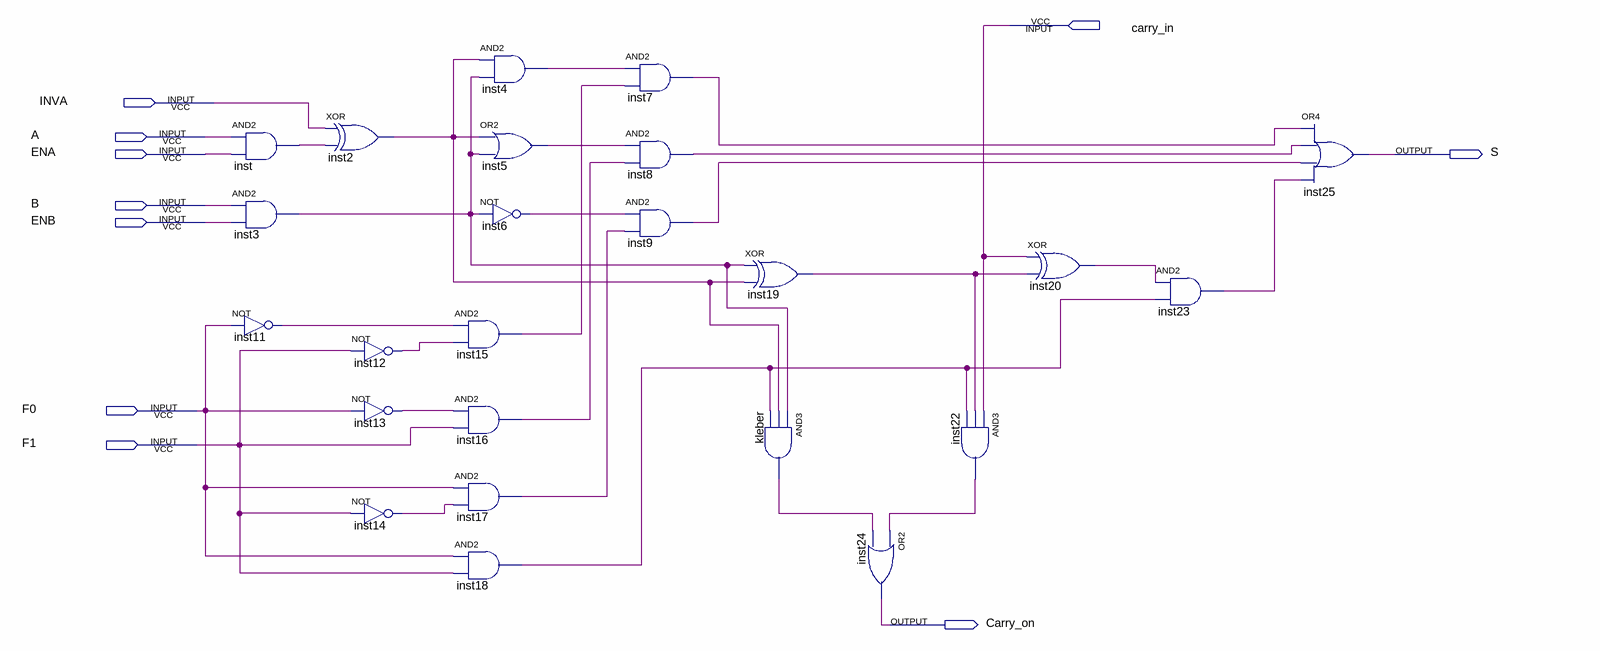
[diagram p0: schematic sheet]
// Quartus schematic ULA_1BIT.bdf as structural Verilog: 24 symbols, 10 pins
module ULA_1BIT (
  input  carry_in,
  input  INVA,
  input  A,
  input  ENA,
  input  B,
  input  ENB,
  input  F0,
  input  F1,
  output S,
  output Carry_on
);

  wire inst2_out, inst3_out, inst4_out, inst5_out, inst6_out, inst7_out, inst8_out, inst9_out, inst11_out,
       inst12_out, inst13_out, inst14_out, inst15_out, inst16_out, inst17_out, inst18_out, inst19_out,
       inst20_out, inst22_out, inst23_out, inst_out, kleber_out;

  and inst (inst_out, A, ENA);
  and inst3 (inst3_out, B, ENB);
  not inst11 (inst11_out, F0);
  xor inst2 (inst2_out, INVA, inst_out);
  not inst12 (inst12_out, F1);
  not inst13 (inst13_out, F0);
  not inst14 (inst14_out, F1);
  and inst4 (inst4_out, inst2_out, inst3_out);
  or inst5 (inst5_out, inst2_out, inst3_out);
  not inst6 (inst6_out, inst3_out);
  and inst15 (inst15_out, inst11_out, inst12_out);
  and inst16 (inst16_out, inst13_out, F1);
  and inst17 (inst17_out, F0, inst14_out);
  and inst18 (inst18_out, F0, F1);
  and inst7 (inst7_out, inst4_out, inst15_out);
  and inst8 (inst8_out, inst5_out, inst16_out);
  and inst9 (inst9_out, inst6_out, inst17_out);
  xor inst19 (inst19_out, inst3_out, inst2_out);
  and kleber (kleber_out, inst3_out, inst2_out, inst18_out);
  or inst24 (Carry_on, inst22_out, kleber_out);
  and inst22 (inst22_out, carry_in, inst19_out, inst18_out);
  xor inst20 (inst20_out, carry_in, inst19_out);
  and inst23 (inst23_out, inst20_out, inst18_out);
  or inst25 (S, inst7_out, inst8_out, inst9_out, inst23_out);
endmodule
